# Altium schematic sheet J65ACIA.SchDoc
size A4
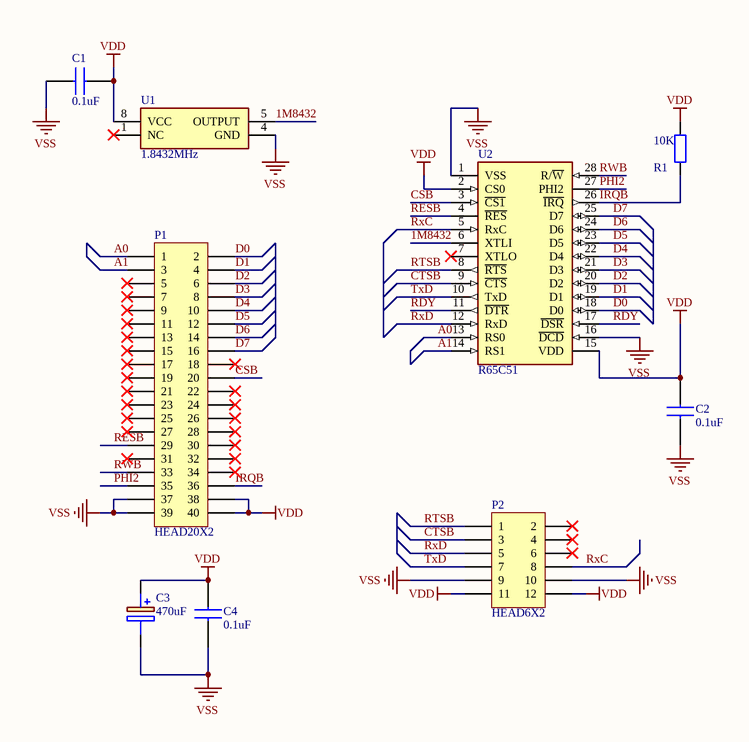
[diagram p0: J65ACIA.SchDoc]

## Parts
C1  0.1uF  [CAP508]
C2  0.1uF  [CAP508]
C3  470uF  [CAP8X12]
C4  0.1uF  [CAP508]
P1  HEAD20X2  [HD20X2]
P2  HEAD6X2  [HD6X2]
R1  10K  [AXIAL-0.4]
U1  1.8432MHz  [OSC4P]
U2  R65C51  [DIP28V]

## Nets
VDD: C1.1 C2.1 C3.1(+) C4.1 P1.38 P1.40 P2.11 P2.12 R1.1 U1.8(VCC) U2.2(CS0) U2.15(VDD)
VSS: C1.2 C2.2 C3.2(-) C4.2 P1.37 P1.39 P2.9 P2.10 U1.4(GND) U2.1(VSS) U2.16(~{DCD})
1M8432: U1.5(OUTPUT) U2.6(XTLI)
A0: P1.1 U2.13(RS0)
A1: P1.3 U2.14(RS1)
CSB: P1.20 U2.3(~{CS1})
CTSB: P2.3 U2.9(~{CTS})
D0: P1.2 U2.18(D0)
D1: P1.4 U2.19(D1)
D2: P1.6 U2.20(D2)
D3: P1.8 U2.21(D3)
D4: P1.10 U2.22(D4)
D5: P1.12 U2.23(D5)
D6: P1.14 U2.24(D6)
D7: P1.16 U2.25(D7)
IRQB: P1.36 R1.2 U2.26(~{IRQ})
PHI2: P1.35 U2.27(PHI2)
RDY: U2.11(~{DTR}) U2.17(~{DSR})
RESB: P1.29 U2.4(~{RES})
RTSB: P2.1 U2.8(~{RTS})
RWB: P1.33 U2.28(R/~{W})
RxC: P2.8 U2.5(RxC)
RxD: P2.5 U2.12(RxD)
TxD: P2.7 U2.10(TxD)

Not connected (* = marked no-connect by the designer): P1 5* 7* 9* 11* 13* 15* 17* 18* 19* 21* 22* 23* 24* 25* 26* 27* 28* 30* 31* 32* 34*; P2 2* 4* 6*; U1 1(NC)*; U2 7(XTLO)*

## Notes on the sheet
- Title
- Size:
- Date:
- A4
- Number:
- Time:
- Revision:
- Sheet
- of
- File:

## Library data of the parts
C1 C2 C4 = CAP1
C3 = CAP2
R1 = RES1
U1 = OSCX
P1 = HEAD20X2: LatestRevisionDate: 17-Jul-2002; LatestRevisionNote: Re-released for DXP Platform.; Publisher: Altium Limited
P2 = HEAD6X2: LatestRevisionDate: 17-Jul-2002; LatestRevisionNote: Re-released for DXP Platform.; Publisher: Altium Limited